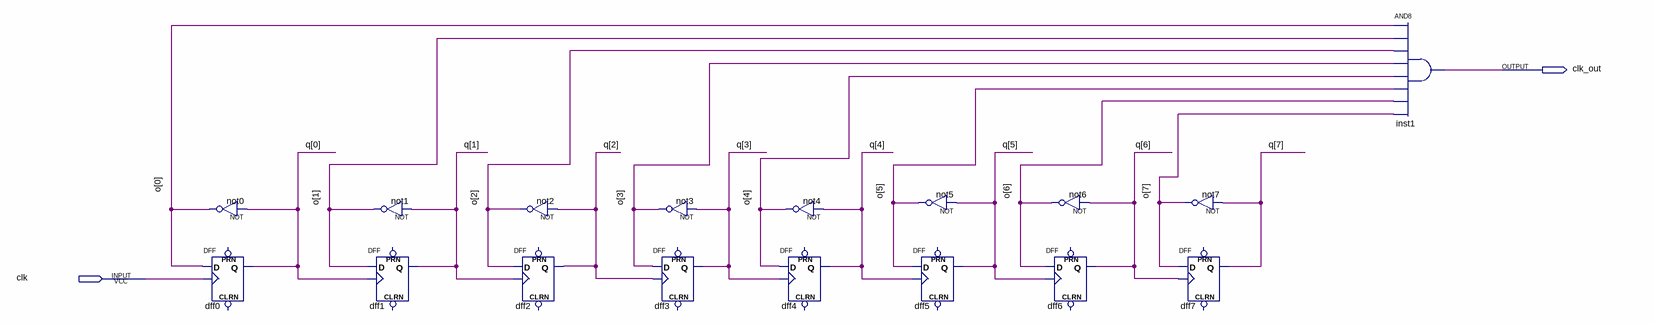
[diagram p0: schematic sheet]
// Quartus schematic Counter1.bdf as structural Verilog: 17 symbols, 2 pins
module Counter1 (
  input  clk,
  output clk_out
);

  wire [7:0] o, q;

  not not0 (o[0], q[0]);
  DFF dff0 (.CLK(clk), .D(o[0]), .Q(q[0]));  // open: CLRN, PRN
  not not1 (o[1], q[1]);
  DFF dff1 (.CLK(q[0]), .D(o[1]), .Q(q[1]));  // open: CLRN, PRN
  DFF dff2 (.CLK(q[1]), .D(o[2]), .Q(q[2]));  // open: CLRN, PRN
  not not2 (o[2], q[2]);
  not not3 (o[3], q[3]);
  DFF dff3 (.CLK(q[2]), .D(o[3]), .Q(q[3]));  // open: CLRN, PRN
  not not4 (o[4], q[4]);
  DFF dff4 (.CLK(q[3]), .D(o[4]), .Q(q[4]));  // open: CLRN, PRN
  not not5 (o[5], q[5]);
  DFF dff5 (.CLK(q[4]), .D(o[5]), .Q(q[5]));  // open: CLRN, PRN
  not not6 (o[6], q[6]);
  DFF dff6 (.CLK(q[5]), .D(o[6]), .Q(q[6]));  // open: CLRN, PRN
  not not7 (o[7], q[7]);
  DFF dff7 (.CLK(q[6]), .D(o[7]), .Q(q[7]));  // open: CLRN, PRN
  and inst1 (clk_out, o[0], o[1], o[2], o[3], o[4], o[5], o[6], o[7]);
endmodule
